# EAGLE design PTI (EAGLE 9.5.1)
DWG_NUMBER: CKT-1000; REV: C; TITLE: PIMTECTOR INTERFACE BOARD
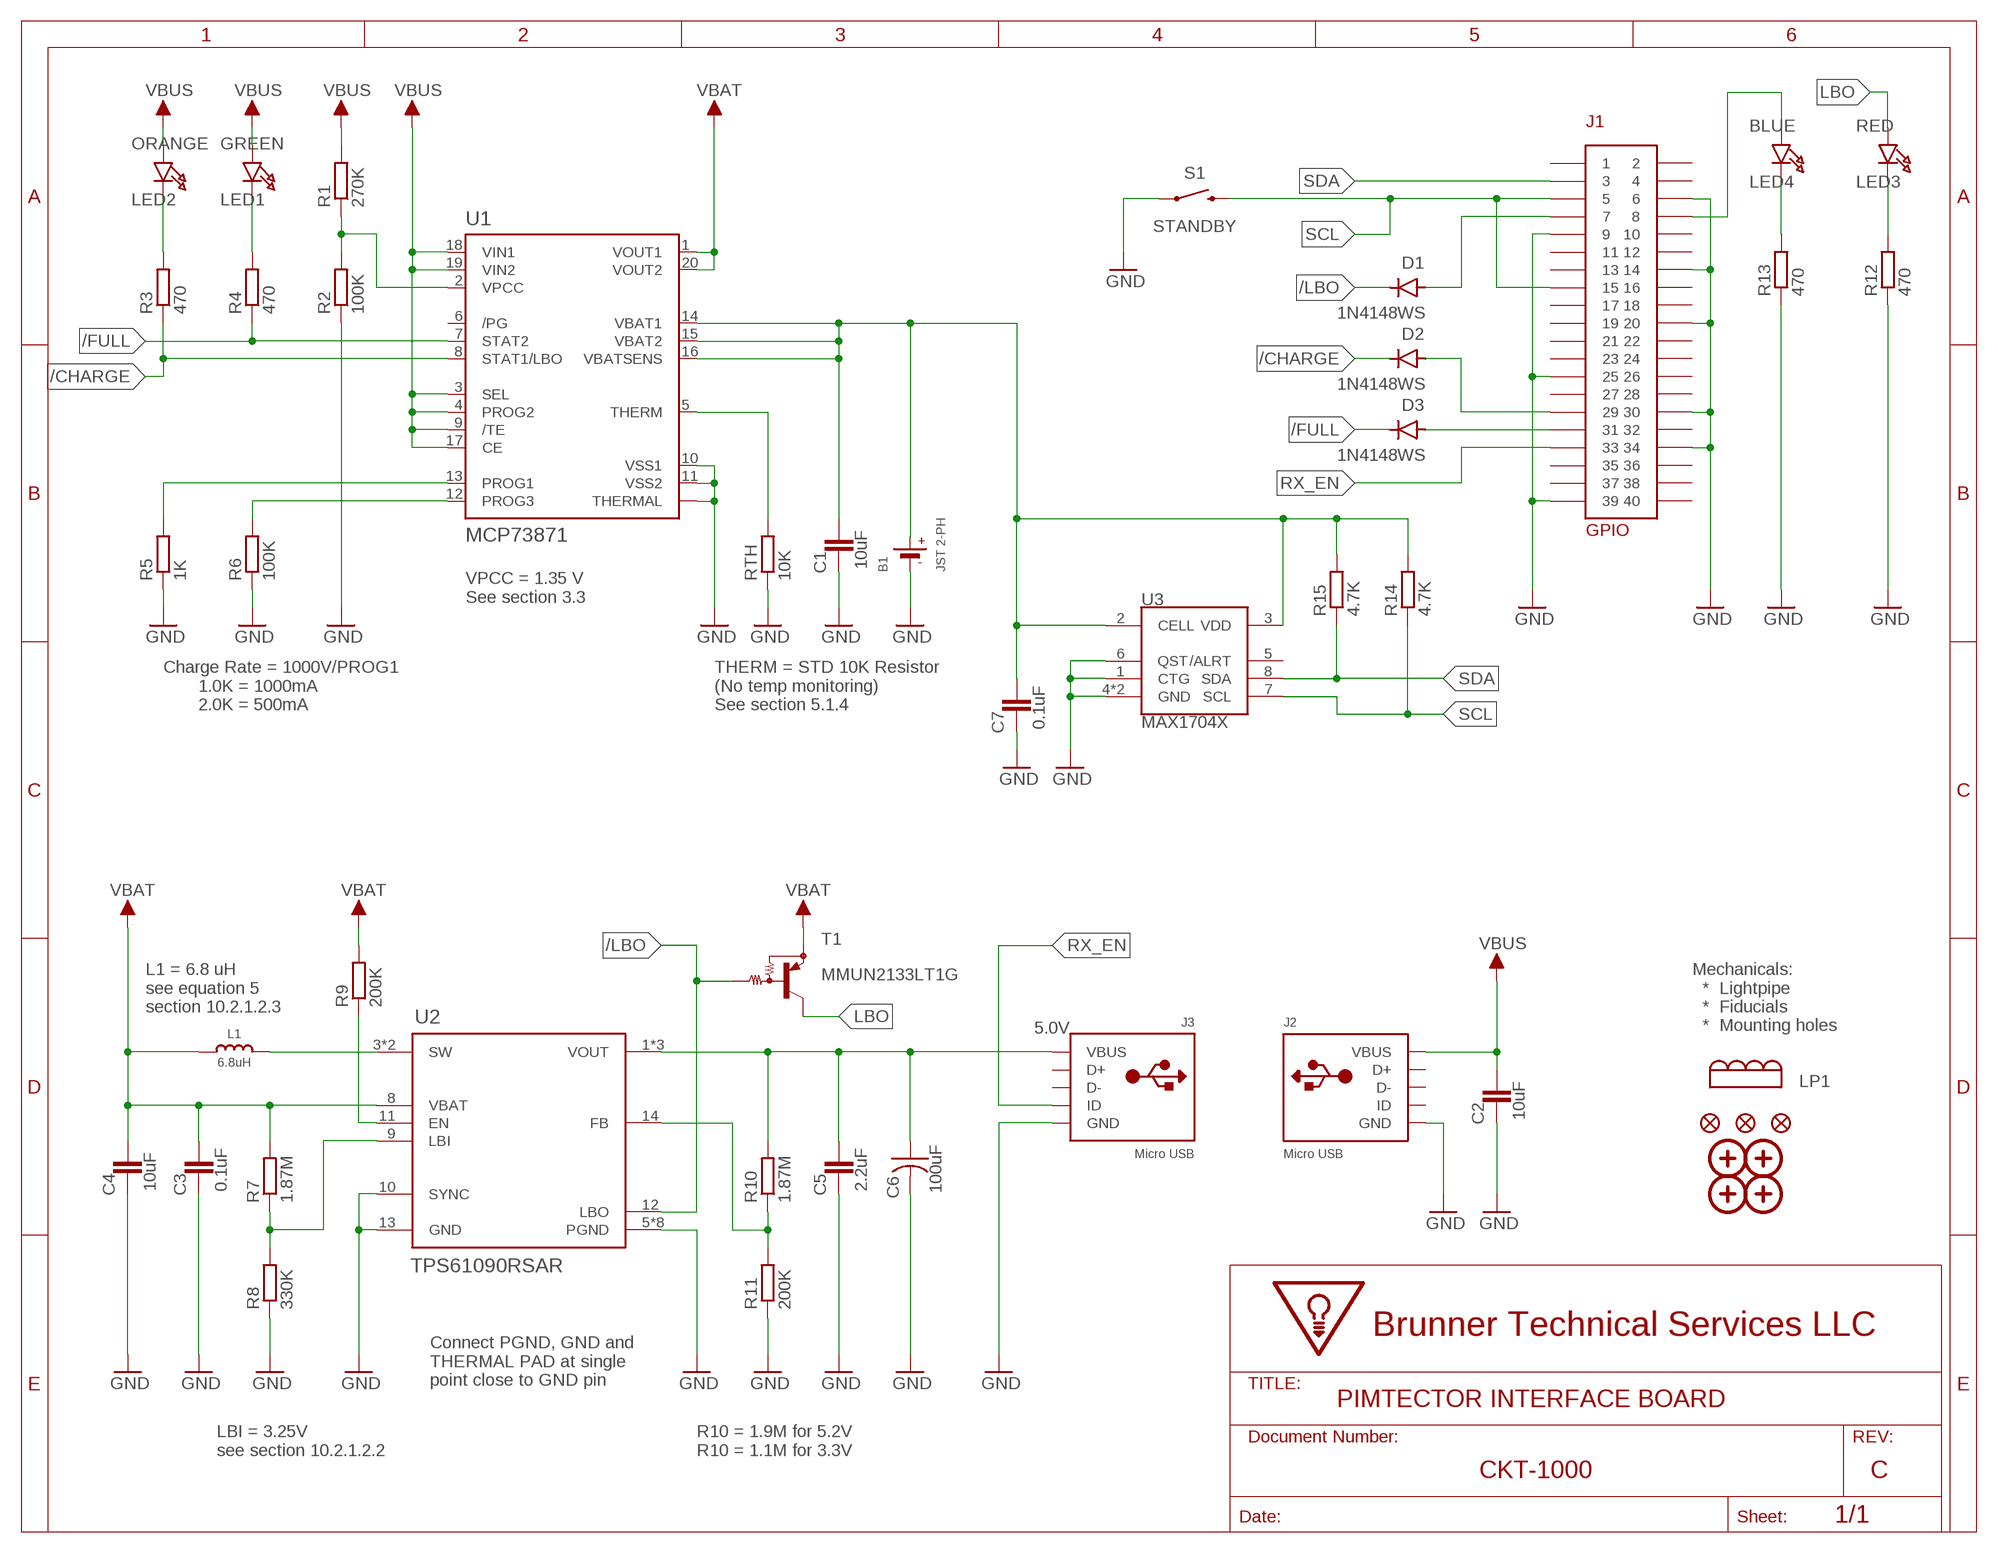
[diagram p0: schematic, sheet 1]

## Parts
B1  JST 2-PH  BATTERY  [JSTPH2]
C1  10uF  C-EUC0805  [C0805]
C2  10uF  C-EUC0805  [C0805]
C3  0.1uF  C-EUC0805  [C0805]
C4  10uF  C-EUC0805  [C0805]
C5  2.2uF  C-EUC0805  [C0805]
C6  100uF  C-USC1210  [C1210]
C7  0.1uF  C-EUC0805  [C0805]
D1  1N4148WS  [SOD-323]
D2  1N4148WS  [SOD-323]
D3  1N4148WS  [SOD-323]
FID1  FIDUCIAL""  [FIDUCIAL_1MM]
FID2  FIDUCIAL""  [FIDUCIAL_1MM]
FID3  FIDUCIAL""  [FIDUCIAL_1MM]
J1  GPIO  HEADER-FE-2X20THRU-HOLE  [HEADER-FE-2X20-TH]
J2  Micro USB  USB  [AMPHENOL_10103594]
J3  Micro USB  USB  [AMPHENOL_10103594]
L1  6.8uH  INDUCTORTDK_VLC5045  [INDUCTOR_5X5MM_TDK_VLC5045]
LED1  GREEN  LED0805_NOOUTLINE  [CHIPLED_0805_NOOUTLINE]
LED2  ORANGE  LED0805_NOOUTLINE  [CHIPLED_0805_NOOUTLINE]
LED3  RED  LED0805_NOOUTLINE  [CHIPLED_0805_NOOUTLINE]
LED4  BLUE  LED0805_NOOUTLINE  [CHIPLED_0805_NOOUTLINE]
LP1  LIGHTPIPE  [LIGHTPIPE_QUAD_VERT_3MM]
MH1  MOUNTING-HOLES  [MOUNTING-HOLE-2.75X3MM]
MH2  MOUNTING-HOLES  [MOUNTING-HOLE-2.75X3MM]
MH3  MOUNTING-HOLES  [MOUNTING-HOLE-2.75X3MM]
MH4  MOUNTING-HOLES  [MOUNTING-HOLE-2.75X3MM]
R1  270K  R-EU_R0805  [R0805]
R2  100K  R-EU_R0805  [R0805]
R3  470  R-EU_R0805  [R0805]
R4  470  R-EU_R0805  [R0805]
R5  1K  R-EU_R0805  [R0805]
R6  100K  R-EU_R0805  [R0805]
R7  1.87M  R-EU_R0805  [R0805]
R8  330K  R-EU_R0805  [R0805]
R9  200K  R-EU_R0805  [R0805]
R10  1.87M  R-EU_R0805  [R0805]
R11  200K  R-EU_R0805  [R0805]
R12  470  R-EU_R0805  [R0805]
R13  470  R-EU_R0805  [R0805]
R14  4.7K  R-EU_R0805  [R0805]
R15  4.7K  R-EU_R0805  [R0805]
RTH  10K  R-EU_R0805  [R0805]
S1  STANDBY  MOMENTARY-SWITCH-SPST-PTH-12MM  [TACTILE_SWITCH_PTH_12MM]
T1  MMUN2133LT1G  MUN2111T1-PNP_DRIVER-SC59-BEC  [SC59-BEC]
U1  MCP73871  [QFN20_4MM]
U2  TPS61090RSAR  TPS6109X  [RSA16_4MMX4MM_VQFN]
U3  MAX1704X  [TDFN-8]

## Nets
5.0V: C5.1 C6.1 J3.VBUS R10.2 U2.1(VOUT) U2.15(VOUT) U2.16(VOUT)
/CHARGE: D2.C R3.1 U1.8(STAT1/LBO)
/FULL: D3.C R4.1 U1.7(STAT2)
/LBO: D1.C T1.B U2.12(LBO)
GND: B1.1(-) B1.NC1(-) B1.NC2(-) C1.2 C2.2 C3.2 C4.2 C5.2 C6.2 C7.2 J1.P$6 J1.P$9 J1.P$14 J1.P$20 J1.P$25 J1.P$30 J1.P$34 J1.P$39 J2.BASE@1(GND) J2.BASE@2(GND) J2.GND J2.SPRT@1(GND) J2.SPRT@2(GND) J2.SPRT@3(GND) J2.SPRT@4(GND) J3.BASE@1(GND) J3.BASE@2(GND) J3.GND J3.SPRT@1(GND) J3.SPRT@2(GND) J3.SPRT@3(GND) J3.SPRT@4(GND) R2.1 R5.1 R6.1 R8.1 R11.1 R12.1 R13.1 RTH.1 S1.1 U1.10(VSS1) U1.11(VSS2) U1.P$21(THERMAL) U1.P$22(THERMAL) U1.P$23(THERMAL) U1.P$24(THERMAL) U2.5(PGND) U2.6(PGND) U2.7(PGND) U2.10(SYNC) U2.13(GND) U2.P$17(PGND) U2.P$18(PGND) U2.P$19(PGND) U2.P$20(PGND) U2.P$21(PGND) U3.1(CTG) U3.4(GND) U3.6(QST) U3.EP(GND)
LBO: LED3.A T1.C
N$1: RTH.2 U1.5(THERM)
N$2: R1.1 R2.2 U1.2(VPCC)
N$3: D1.A J1.P$7
N$4: D2.A J1.P$29
N$5: R5.2 U1.13(PROG1)
N$6: R6.2 U1.12(PROG3)
N$7: LED2.C R3.2
N$8: LED1.C R4.2
N$9: B1.2(+) C1.1 C7.1 R14.2 R15.2 U1.14(VBAT1) U1.15(VBAT2) U1.16(VBATSENS) U3.2(CELL) U3.3(VDD)
N$10: L1.P$2 U2.3(SW) U2.4(SW)
N$11: R7.1 R8.2 U2.9(LBI)
N$13: R9.1 U2.11(EN)
N$15: R10.1 R11.2 U2.14(FB)
N$16: LED3.C R12.2
N$17: D3.A J1.P$31
N$18: LED4.C R13.2
RX_EN: J1.P$33 J3.ID
SCL: J1.P$5 J1.P$15 R14.1 S1.3 U3.7(SCL)
SDA: J1.P$3 R15.1 U3.8(SDA)
STATUS: J1.P$8 LED4.A
VBAT: C3.1 C4.1 L1.P$1 R7.2 R9.2 T1.E U1.1(VOUT1) U1.20(VOUT2) U2.8(VBAT)
VBUS: C2.1 J2.VBUS LED1.A LED2.A R1.2 U1.3(SEL) U1.4(PROG2) U1.9(/TE) U1.17(CE) U1.18(VIN1) U1.19(VIN2)
Unconnected: J1.P$1 J1.P$2 J1.P$4 J1.P$10 J1.P$11 J1.P$12 J1.P$13 J1.P$16 J1.P$17 J1.P$18 J1.P$19 J1.P$21 J1.P$22 J1.P$23 J1.P$24 J1.P$26 J1.P$27 J1.P$28 J1.P$32 J1.P$35 J1.P$36 J1.P$37 J1.P$38 J1.P$40 J2.D+ J2.D- J2.ID J3.D+ J3.D- U1.6(/PG) U3.5(/ALRT)

## Notes on the sheet
- VPCC = 1.35 V
  See section 3.3
- Charge Rate = 1000V/PROG1
         1.0K = 1000mA
         2.0K = 500mA
- THERM = STD 10K Resistor
  (No temp monitoring)
  See section 5.1.4
- L1 = 6.8 uH
  see equation 5
  section 10.2.1.2.3
- Mechanicals:
    *  Lightpipe
    *  Fiducials
    *  Mounting holes
- Connect PGND, GND and
  THERMAL PAD at single
  point close to GND pin
- LBI = 3.25V
  see section 10.2.1.2.2
- R10 = 1.9M for 5.2V
  R10 = 1.1M for 3.3V

## Library data of the parts
B1 = brunnertech:BATTERY: CR1220 SMT - Digikey: 3001K-ND CD2032 BAT-HLD-001 - Digikey: BAT-HLD-001-ND
C1-C5 C7 = brunnertech:C-EU: CAPACITOR, European symbol; SPICEPREFIX: C
C6 = brunnertech:C-US: CAPACITOR, American symbol; SPICEPREFIX: C
D1-D3 = brunnertech:1N4148WS: DIODE GEN PURP 75V 150MA SOD323F Manufacturer's datasheet <https://www.onsemi.com/pub/Collateral/1N914BWS-D.pdf>; CREATED_BY: PCBLayout.com; DIGIKEY_PART_NUMBER: 1N4148WSFSTR-ND; MANUFACTURER: Diodes Incorporated; MPN: 1N4148WS; PACKAGE: SOD-323
FID1-FID3 = brunnertech:FIDUCIAL: Fiducial Alignment Points Various fiducial points for machine vision alignment.; BOM: EXCLUDE
J1 = brunnertech:HEADER-FE-2X20
J2 J3 = brunnertech:USB: USB Connectors USBMINIB - Surface Mount Female Mini-B USB Connector 4UConnector: 06564
L1 = brunnertech:INDUCTOR: Inductors 0603: 10nH Ceramic Inductor - microwire antenna/RF (Digikey: 712-1434-2-ND) 0805: 560nH Ceramic Inductor - RF (Digikey: 553-1047-1-ND) 270nH Ceramic Inductor - Q = 40@250MHz, +-5%, 1 Ohm DC Resistance (Digikey: 535-10506-2-ND) 1007 (2518 Metric) SMT: 10µH 10% 250mOhm 820mA 1007 Inductor (Digikey: 587-2189-1-ND) 22µH 10% 500mOhm 580mA 1007 Inductor (Digikey: 587-2190-1-ND) 47µH 10% 950mOhm 420mA 1007 Inductor (Digikey: 587-2191-1-ND) 47µH 5% 100mOhm 1A 1008 Inductor (Digikey: 732-1816-1-ND) 5.0x5.0mm (Taiyo Yuden NR5040 Series) 6.8µH 20% 2.3A 64mOhm Inductor (Digikey: 587-2374-2-ND) 5.0x5.0mm (TDK VLC5045 Series) 4.7µH 20% 3.3A 34mOhm Inductor (Digikey: 445-6526-1-ND) 6.8µH 20% 2.7A 46mOhm Inductor (Digikey: 445-6527-1-ND) 6.0x6.0mm (TDK VLC6045 Series) 4.7µH 20% 3.8A 27mOhm Inductor (Digikey: 445-6538-2-ND) 6.8µH 20% 3A 41mOhm Inductor (Digikey: 445-6540-1-ND) 6.2µH 30% 2.2A 45mOhm Inductor (Digikey: SRR5028-6R2YCT-ND) - Not TDK VLC6045 but footprint should match 6.0x6.0mm (TDK SLF6045 Series) 6.8uH 30% 2A 33mOhm Inductor (Digikey: 445-4572-1-ND, Mouser: 810-SLF645T6R8N2R0PF) 6.0x6.0mm (Sumida CDRH5D28 Series) 6.2uH 30% 1.8A 45mOhm Inductor (Digikey: 308-1542-1-ND) Taiyo Yuden NR3015T2R2M - 2.2uH 20% 1.5A (Digikey: 587-1648-2-ND, Mouser: 963-NR3015T2R2M) - Used with TI TPS62172 CoilCraft RFID Transponder Coil - MA5532-AE (For use with AS3935 Lightning Sensor) Vishay IHLP 1.0uH Molded Inductor - 24mOhm DCR, 5A, +/-20%, -55°C-125°C (Digikey: 541-1319-1-ND)
LED1-LED4 = brunnertech:LED: LED 0603 - 0603 Surface Mount Package 2mA: Green LED - Low Power (3.9mcd, 2ma, 1.7Vf) - Digikey: 475-2709-2-ND Orange LED - Low Power (9.8mcd, 2ma, 1.8Vf) - Digikey: 475-1194-2-ND Red LED - Low Power (5mcd, 2ma, 1.8Vf) - Digikey: 475-1195-2-ND Yellow LED - Low Power (7mcd, 2ma, 1.8Vf) - Digikey: 475-1196-2-ND 5mA: Blue LED - Low Power (17mcd, 5ma, 2.9Vf) - Digikey: LNJ937W8CRACT-ND 0805 - 0805 Surface Mount Package 2mA: Red LED (8.8mcd, 2mA, 1.8Vf, Clear) - Low Power [Digikey: 475-2510-1-ND] Green LED (5mcd, 2mA, 1.8Vf, Clear) - Low Power [Digikey: 475-2730-1-ND] Yellow LED (11.3mcd, 2mA, 1.8Vf, Clear) - Low Power [Digikey: 475-2555-1-ND] 20mA: Red LED (104mcd, 20mA, Diffused) - LS R976 [Digikey: 475-1278-6-ND] Red LED (12mcd, 20mA, 2.0Vf, Clear) - APT2012EC [Digikey: 754-1128-1-ND] Green LED (15mcd, 20mA, 2.2Vf, Clear) - APT2012GC [Digikey: 754-1131-1-ND] Orange LED (160mcd, 20mA, 2.1Vf, Clear) - APT2012SECK [Digikey: 754-1130-1-ND] 1206 - 1206 Surface Mount Package Green LED (26mcd, 20mA, Diffused) - LG N971 [Digikey: 475-1407-6-ND] Red LED (15mcd, 20mA, Diffused) - LH N974 [Digikey: 475-1416-6-ND] Cree - Cree High-Power Surface Mount LEDs XPEBWT-L1-0000-00D50 - White 111lm 350mA 2.9Vf 6200K 110° XTEAWT-00-0000-00000LEE3 - White 114lm 350mA 2.85Vf 5000K 115° Everlight - Everlight 45-21 Series Surface Mount LEDs 45-21/QK2C-B2832AC2CB2/2T - Warm White 2000mcd 20mA 3.25Vf 3050K 120° 45-21/LK2C-B38452C4CB2/2T - Nuetral White 2000mcd 20mA 3.25Vf 4150K 120° 45-21/LK2C-B50634C6CB2/2T - Cold White 2200mcd 20mA 3.25Vf 5650K 120° PLCC2 Reverse Mount LS T77K-J1L2-1-0-2-R18-Z - Red 11.25mcd 2mA 1.8Vf 630nm 120° LO T77K-L1M2-24-Z - Orange 19.6mcd 2mA 1.8Vf 606nm 120° LY T77K-K2M1-26-Z - Yellow 15.7mcd 2mA 1.8Vf 587nm 120°
LP1 = brunnertech:LIGHTPIPE: Lightpipe assembly
MH1-MH4 = brunnertech:MOUNTING-HOLES
R1-R15 RTH = brunnertech:R-EU_: RESISTOR, European symbol; SPICEPREFIX: R
S1 = brunnertech:MOMENTARY-SWITCH-SPST: Momentary Switch (Pushbutton) - SPST Normally-open (NO) SPST momentary switches (buttons, pushbuttons). Variants PTH-12MM - 12mm square, through-hole Momentary Pushbutton Switch - 12mm Square <https://www.sparkfun.com/products/9190> (COM-09190) PTH-6.0MM, PTH-6.0MM-KIT - 6.0mm square, through-hole Mini Pushbutton Switch <https://www.sparkfun.com/products/97> (COM-00097) KIT package intended for soldering kit's - only one side of pads' copper is exposed. PTH-RIGHT-ANGLE-KIT - Right-angle, through-hole Right Angle Tactile Button <https://www.sparkfun.com/products/10791> - Used on SparkFun BigTime Watch Kit <https://www.sparkfun.com/products/11734> SMD-12MM - 12mm square, surface-mount Tactile Button - SMD (12mm) <https://www.sparkfun.com/products/12993> (COM-12993) Used on SparkFun PicoBoard <https://www.sparkfun.com/products/11888> SMD-4.5MM - 4.5mm Square Trackball Switch Used on SparkFun Blackberry Trackballer Breakout <https://www.sparkfun.com/products/13169> SMD-4.6MMX2.8MM - 4.60mm x 2.80mm, surface mount Used on SparkFun SAMD21 Mini Breakout <https://www.sparkfun.com/products/13664> SMD-5.2MM, SMD-5.2-REDUNDANT - 5.2mm square, surface-mount Mini Pushbutton Switch - SMD <https://www.sparkfun.com/products/8720> (COM-08720) Used on Arduino Pro Mini <https://www.sparkfun.com/products/11114> REDUNDANT package connects both switch circuits together SMD-6.0X3.5MM - 6.0 x 3.5mm, surface mount Momentary Reset Switch SMD <https://www.sparkfun.com/products/8229> (COM-08229) SMD-6.2MM-TALL - 6.2mm square, surface mount Tactile Button - SMD (6mm) <https://www.sparkfun.com/products/12992> Used on SparkFun Digital Sandbox <https://www.sparkfun.com/products/12651> SMD-RIGHT-ANGLE - Right-angle, surface mount Used on SparkFun Block for Intel® Edison - Arduino <https://www.sparkfun.com/products/13036>; PROD_ID: SWCH-09185; SF_SKU: COM-09190
T1 = brunnertech:*-PNP_DRIVER-: PNP Bias Resistor Transistor
U1 = brunnertech:MCP73871: MCP73871 Lithium Polymer Battery Charger Digikey: MCP73871-2CCI/ML-ND
U2 = brunnertech:TPS6109X: Synchronous Boost Converter with 2A Switch; MANUFACTURER: TI
U3 = brunnertech:MAX1704X: MAX17043/MAX17044: Battery Fuel Guage (43 is 1cell, 44 is 2cell)

## Board
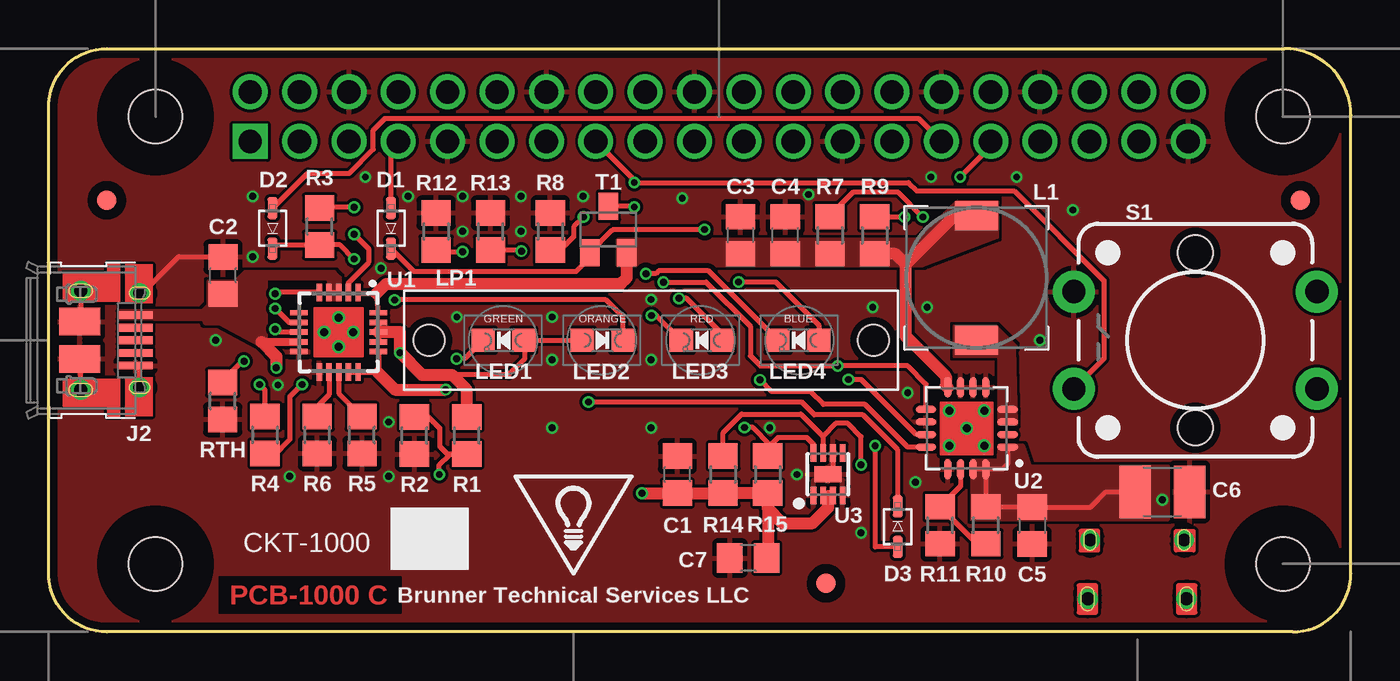
[diagram p1: board, top side]
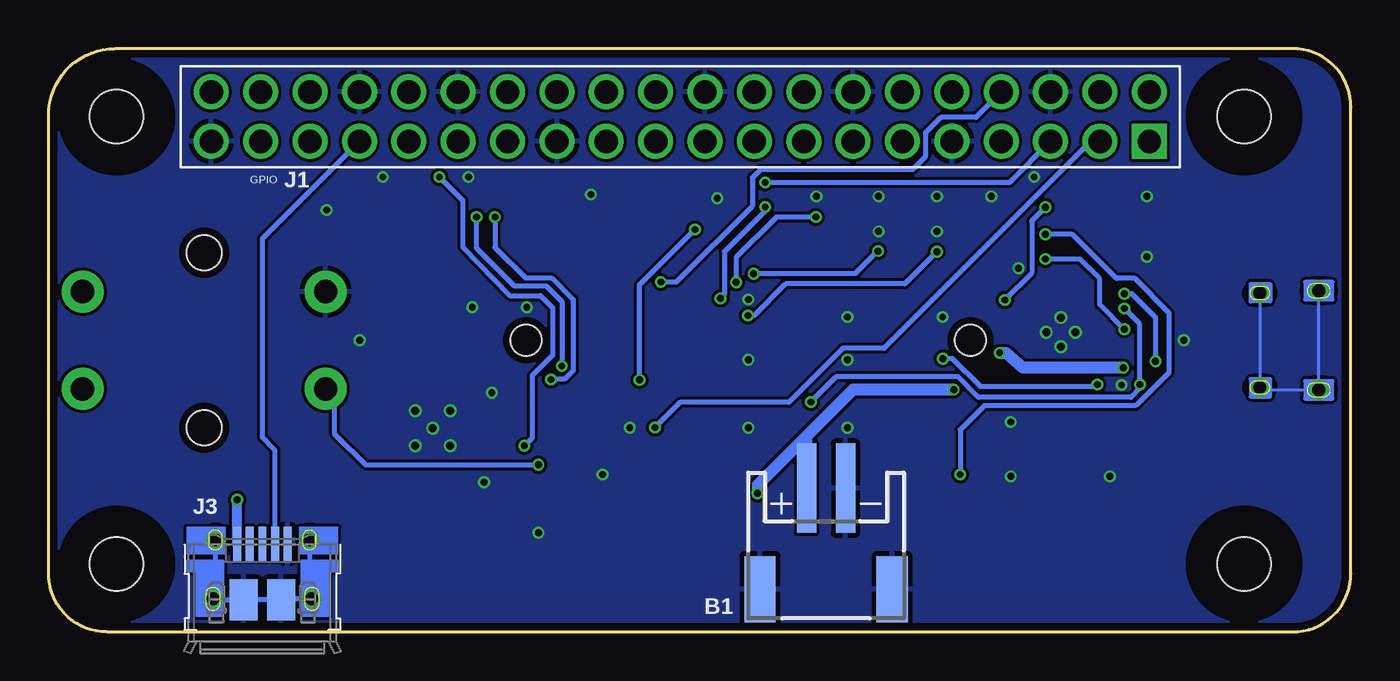
[diagram p2: board, bottom side, seen from below]

Size 67 x 30 mm. Coordinates in mm from the lower left corner, seen from the top.
Outline: 64,0 3,0 arc-90 0,3 0,27 arc-90 3,30 63.59,30 arc-90 67,26.59 67,3 arc-90 64,0
Copper layers (1*16): Top 0.035559375mm / dielectric 1.6mm / Bottom 0.035559375mm
Design rules "oshpark-2layer *": minimum track width 6mil, minimum drill 10mil, track to track 6mil, track to pad 6mil, pad to pad 6mil, via to via 6mil, smd to smd 6mil, copper to edge 15mil, drill to drill 6mil, minimum pad ring 5mil, minimum via ring 5mil, stop-mask expansion 2.5mil, vias tented up to drill 0mil, thermal gap 10mil

### Footprints (pad centres in the part's own frame; a part is rotated, then mirrored left to right if it is on the bottom)
JSTPH2 = smd 1 x 4.6: 1 -1,-3.7; 2 1,-3.7 | smd 1.6 x 3.4: NC1 -3.4,1.5; NC2 3.4,1.5
C0805 = smd 1.3 x 1.5: 1 -0.95,0; 2 0.95,0
C1210 = smd 1.6 x 2.7: 1 -1.4,0; 2 1.4,0
SOD-323 = smd 1.14 x 0.52: A 1.04,0; C -1.04,0
FIDUCIAL_1MM = smd 1 x 1: 1 0,0
HEADER-FE-2X20-TH = drill 1.2 square: P$1 1.27,24.13 | drill 1.2: P$2 -1.27,24.13; P$3 1.27,21.59; P$4 -1.27,21.59; P$5 1.27,19.05; P$6 -1.27,19.05; P$7 1.27,16.51; P$8 -1.27,16.51; P$9 1.27,13.97; P$10 -1.27,13.97; P$11 1.27,11.43; P$12 -1.27,11.43; P$13 1.27,8.89; P$14 -1.27,8.89; P$15 1.27,6.35; P$16 -1.27,6.35; P$17 1.27,3.81; P$18 -1.27,3.81; P$19 1.27,1.27; P$20 -1.27,1.27; P$21 1.27,-1.27; P$22 -1.27,-1.27; P$23 1.27,-3.81; P$24 -1.27,-3.81; P$25 1.27,-6.35; P$26 -1.27,-6.35; P$27 1.27,-8.89; P$28 -1.27,-8.89; P$29 1.27,-11.43; P$30 -1.27,-11.43; P$31 1.27,-13.97; P$32 -1.27,-13.97; P$33 1.27,-16.51; P$34 -1.27,-16.51; P$35 1.27,-19.05; P$36 -1.27,-19.05; P$37 1.27,-21.59; P$38 -1.27,-21.59; P$39 1.27,-24.13; P$40 -1.27,-24.13
AMPHENOL_10103594 = smd 1.425 x 2.1: BASE@1 -0.963,-0.05; BASE@2 0.963,-0.05 | smd 0.4 x 1.75: D+ 0,2.825; D- -0.65,2.825; GND 1.3,2.825; ID 0.65,2.825; VBUS -1.3,2.825 | drill 0.65 pad 1: SPRT@1 -2.425,3.03; SPRT@2 2.425,3.03 | drill 0.68 pad 1: SPRT@3 -2.54,0; SPRT@4 2.54,0
INDUCTOR_5X5MM_TDK_VLC5045 = smd 1.5 x 2.2: P$1 -3.2,0; P$2 3.2,0
CHIPLED_0805_NOOUTLINE = smd 1.2 x 1.2: A 0,-1.05; C 0,1.05
LIGHTPIPE_QUAD_VERT_3MM = hole 1.6: 11.43,0; -11.43,0
MOUNTING-HOLE-2.75X3MM = hole 2.75: 0,0
R0805 = smd 1.3 x 1.5: 1 -0.95,0; 2 0.95,0
TACTILE_SWITCH_PTH_12MM = drill 1.2 pad 2.159: 1 6.25,-2.5; 2 -6.25,-2.5; 3 6.25,2.5; 4 -6.25,2.5 | hole 1.8: 0,4.5; 0,-4.5
SC59-BEC = smd 1 x 1.4: B -0.95,-1.2; C 0,1.2; E 0.95,-1.2
QFN20_4MM = smd 0.9 x 0.28: 1 -2.05,1; 2 -2.05,0.5; 3 -2.05,0; 4 -2.05,-0.5; 5 -2.05,-1; 11 2.05,-1; 12 2.05,-0.5; 13 2.05,0; 14 2.05,0.5; 15 2.05,1 | smd 0.28 x 0.9: 6 -1,-2.05; 7 -0.5,-2.05; 8 0,-2.05; 9 0.5,-2.05; 10 1,-2.05; 16 1,2.05; 17 0.5,2.05; 18 0,2.05; 19 -0.5,2.05; 20 -1,2.05 | drill 0.4: P$21 0,0.75; P$22 -0.75,0; P$23 0,-0.75; P$24 0.75,0
RSA16_4MMX4MM_VQFN = smd 1.05 x 0.35: 1 -2.1,0.975; 2 -2.1,0.325; 3 -2.1,-0.325; 4 -2.1,-0.975; 9 2.1,-0.975; 10 2.1,-0.325; 11 2.1,0.325; 12 2.1,0.975 | smd 0.35 x 1.05: 5 -0.975,-2.1; 6 -0.325,-2.1; 7 0.325,-2.1; 8 0.975,-2.1; 13 0.975,2.1; 14 0.325,2.1; 15 -0.325,2.1; 16 -0.975,2.1 | drill 0.4: P$17 0,0; P$18 -0.9,0.9; P$19 0.9,0.9; P$20 -0.9,-0.9; P$21 0.9,-0.9
TDFN-8 = smd 0.9 x 0.3: 1 -1.09,0.75; 2 -1.09,0.25; 3 -1.09,-0.25; 4 -1.09,-0.75; 5 1.09,-0.75; 6 1.09,-0.25; 7 1.09,0.25; 8 1.09,0.75 | smd 0.8 x 1.38: EP 0,0

### Placement (x,y rotation side)
B1  27,3.7 180 bottom
C1  32.35,8.09 90 top
C2  8.97,18.34 90 top
C3  35.6,20.4 90 top
C4  37.9,20.4 90 top
C5  50.6,5.47 270 top
C6  57.3,7.2 0 top
C7  36,3.8 180 top
D1  17.61,20.76 90 top
D2  11.53,20.76 90 top
D3  43.69,5.42 270 top
FID1  64.4,22.2 0 top
FID2  3,22.2 0 top
FID3  40,2.5 0 top
J1  34.5,26.5 270 bottom
J2  1.65,15 270 top
J3  56,1.7 0 bottom
L1  47.73,18.21 270 top
LED1  23.4,15 90 top
LED2  28.5,15 270 top
LED3  33.6,15 90 top
LED4  38.57,15 90 top
LP1  31,15 0 top
MH1  5.5,3.5 0 top
MH2  5.5,26.5 0 top
MH3  63.5,26.5 0 top
MH4  63.5,3.5 0 top
R1  21.52,10.1 90 top
R2  18.82,10.1 90 top
R3  13.94,20.85 90 top
R4  11.13,10.13 270 top
R5  16.12,10.13 90 top
R6  13.82,10.13 90 top
R7  40.2,20.4 270 top
R8  25.81,20.6 270 top
R9  42.5,20.4 270 top
R10  48.22,5.49 90 top
R11  45.87,5.49 90 top
R12  19.94,20.6 270 top
R13  22.73,20.6 270 top
R14  34.7,8.1 270 top
R15  37,8.1 270 top
RTH  8.95,11.88 90 top
S1  59,15 180 top
T1  28.8,20.7 0 top
U1  14.92,15.41 270 top
U2  47.24,10.47 180 top
U3  40.1,8.11 90 top

### Tracks (layer width: path | path; a pad name or v marks a point on that pad's centre or on a via)
5.0V  (via drill 0.35)
  Top 0.254: U2.1 49.34,8.64 49.08,8.38 U2.16 | U2.16 U2.15 | U2.16 R10.2 50.59,6.44 | C5.1 53.62,6.42 54.4,7.2 C6.1
  Top 0.61: C5.1 50.59,6.44
  Bottom 0.152: v57.3,6.8 57.3,6.79
  Bottom 0.508: J3.VBUS 57.3,6.79
  pour Top (no thermals): 47.5,8.8 47.5,5.8 57.6,5.8 57.6,8.5 50.52,8.5 50.14,9.57 48.89,9.57 48.85,8.8
/CHARGE  (via drill 0.35)
  Top 0.254: D2.C 11.71,19.9 R3.1 14.99,19.9 v15.72,19.18 | U1.8 11.81,15.41 v11.65,15.57
  Bottom 0.254: v11.65,15.57 12.92,16.84 12.92,18.16 13.94,19.18 v15.72,19.18
/FULL  (via drill 0.35)
  Top 0.254: U1.7 12.37,15.91 v11.65,16.64 | v10.85,12.72 11.13,12.45 R4.1 | v27.78,11.83 38.73,11.83 39.4,11.16 41.89,11.16 43.69,9.36 D3.C
  Bottom 0.254: v11.65,16.64 10.89,15.88 10.89,12.76 v10.85,12.72 10.85,12.52 11.31,12.07 19.15,12.07 20.2,13.12 26.49,13.12 v27.78,11.83
/LBO  (via drill 0.35)
  Top 0.254: v33.75,20.7 33.72,20.67 29.02,20.67 T1.B 27.85,19.25 27.15,18.54 18.79,18.54 D1.C | U2.12 44.2,9.5 42,11.7 39.86,11.7 39.2,12.36 37.2,12.36 v36.6,12.96
  Bottom 0.254: v36.6,12.96 36.6,17.85 v33.75,20.7
GND  (via drill 0.35)
  Top 0.254: J2.SPRT@3 1.65,16.01 J2.BASE@1 | J2.SPRT@4 1.65,13.99 J2.BASE@2 | J2.SPRT@2 4.68,13.49 J2.GND | J2.SPRT@1 4.83,17.43 6.7,19.3 8.96,19.3 C2.2 | U3.6 40.35,8.36 U3.EP
  Bottom 0.152: J2.SPRT@1 J2.SPRT@2 4.57,12.46 J2.SPRT@4 J2.SPRT@3
  Bottom 0.254: J3.SPRT@3 58.49,1.65 | 58.49,1.65 J3.BASE@1 J3.BASE@2 54.99,1.7 J3.SPRT@4 53.58,1.81 J3.SPRT@2 | J3.SPRT@1 58.42,1.72 58.49,1.65
  other vias: 31,10.5 44.2,12.3 45.2,16.7 42.4,16.7 31,17.1 31,14 51,15 25.9,16.2 21,16.2 32.6,22.3 27.5,22.4 39.1,22.5 49.8,23.4 52.7,21.7 45.4,23.4 24.3,20.6 21.3,20.6 21.3,22.4 24.3,22.4 16.3,23.4 18.5,22.4 17.1,18.7 10.5,22.4 25.9,10.5 25.9,14 17.5,10.8 8.6,15 11.8,12.7 10.5,19.3 12.4,8 17.5,8 41.8,5.1 38.5,8.1 44.6,7.7 37.1,10.5
  cutout Top (no thermals): 8.8,2.8 8.8,1 18.1,1 18.1,2.8
  pour Top (rank 2): 3,30 64,30 arc-90 67,27 67,3 arc-90 64,0 3,0 arc-90 0,3 0,27 arc-90
  pour Bottom (rank 2): 3,30 64,30 arc-90 67,27 67,3 arc-90 64,0 3,0 arc-90 0,3 0,27 arc-90
LBO  (via drill 0.35)
  Top 0.254: v30.13,21.86 30.13,21.9 T1.C | v32.43,17.15 32.83,17.15 34.65,15.33 LED3.A
  Bottom 0.254: v32.43,17.15 32.23,17.35 32.23,19.56 30.13,21.66 v30.13,21.86
N$1  (via drill 0.35)
  Top 0.254: v11.66,17.4 11.73,17.46 U1.5 | RTH.2 8.95,12.93 10.05,14.03 v10.05,13.92
  Bottom 0.254: v10.05,13.92 10.05,16.18 11.27,17.4 v11.66,17.4
N$2  (via drill 0.35)
  Top 0.254: U1.2 15.42,17.97 16.48,19.02 16.48,19.68 v15.72,20.45 | v20.1,8.1 20.1,8.6 20.65,9.15 R1.1 20.52,9.15 20.12,9.55 20.12,10.48 19.55,11.05 R2.2
  Bottom 0.254: v15.72,20.45 14.32,20.45 12.06,18.19 11.13,18.19 9.34,16.4 9.34,13.36 11.06,11.64 18.86,11.64 20.1,10.4 v20.1,8.1
N$3
  Top 0.254: D1.A 17.61,24.86 J1.P$7
N$4
  Top 0.254: D2.A 13.33,23.6 15.49,23.6 16.7,24.81 16.7,25.8 17.31,26.41 44.75,26.41 J1.P$29
N$5
  Top 0.254: U1.13 14.92,12.28 R5.2
N$6
  Top 0.254: U1.12 14.42,12.2 13.94,11.72 13.94,11.2 R6.2
N$7  (via drill 0.35)
  Top 0.254: LED2.C 29.55,16.2 28.68,17.07 v17.8,17.07 | v15.72,21.84 13.98,21.84 R3.2
  Bottom 0.254: v15.72,21.84 16.42,21.14 16.42,18.46 v17.8,17.07
N$8  (via drill 0.35)
  Top 0.254: R4.2 11.53,9.58 11.53,9.02 12.41,9.91 12.41,12.09 v13.05,12.73 | LED1.C 21.41,14.06 v20.99,14.06
  Bottom 0.254: v20.99,14.06 20.49,14.06 19.06,12.63 13.15,12.63 v13.05,12.73
N$9  (via drill 0.35)
  Top 0.254: U1.14 U1.15 16.91,13.37 | 16.91,13.37 16.97,13.31 | U1.16 16.97,13.42 16.91,13.37 | U3.2 40.08,7.02 | 40.08,7.02 40.1,7 | 40.08,7.02 U3.3
  Top 0.61: 16.97,13.31 17.82,12.46 v20.43,12.46 | v30.53,7.13 30.54,7.14 C1.1 R14.2 R15.2 | R15.2 37,3.85 C7.1 | 40.1,7 40.1,6.4 39.3,5.6 37.75,5.6 37,6.35 R15.2
  Bottom 0.61: v20.43,12.46 25.61,12.46 28,10.07 | B1.2 28,10.07 | v30.53,7.13 30.53,7.54 28,10.07
N$10
  pour Top (no thermals): 46.6,15.7 46.6,14.2 48.9,14.2 48.9,10.7 49.78,10.7 49.68,14.58 49.76,14.66 48.73,15.7
N$11  (via drill 0.35)
  Top 0.254: v44.98,21.34 43.71,22.61 41.37,22.61 40.2,21.44 R7.1 | v27.53,21.34 27.02,20.83 27.02,20.32 26.35,19.65 R8.2 | v31.63,17.99 33.83,17.99 36.1,15.72 36.1,14.2 36.62,13.68 v40.59,13.68 44.21,13.68 45.14,12.75 U2.9
  Bottom 0.254: v44.98,21.34 44.98,19.74 43.04,17.8 41.4,17.8 40.59,16.99 v40.59,13.68 | v27.53,21.34 29.56,21.34 31.63,19.27 v31.63,17.99
N$13  (via drill 0.35)
  Top 0.254: v44.04,21.34 42.51,21.34 R9.1 | v41.15,12.98 41.82,12.98 44.65,10.15 U2.11
  Bottom 0.254: v44.04,21.34 44.04,19.77 42.47,18.21 41.13,18.21 40.01,17.09 40.01,13.44 40.45,13 41.13,13 v41.15,12.98
N$15
  Top 0.254: U2.14 46.91,7.48 R11.2 47.77,4.54 R10.1
N$16  (via drill 0.35)
  Top 0.254: R12.2 20.03,19.56 v21.3,19.56 | v31.02,16.27 31.28,16.27 LED3.C
  Bottom 0.254: v21.3,19.56 22.95,17.91 29.08,17.91 30.72,16.27 v31.02,16.27
N$17  (via drill 0.35)
  Top 0.254: J1.P$31 48.47,24.97 v46.9,23.4 | D3.A 42.52,4.38 v42.52,9.57
  Bottom 0.254: v46.9,23.4 45.69,22.19 45.69,19.79 43.28,17.3 41.7,17.3 41.07,16.67 41.07,14.22 42.12,13.17 42.12,9.97 v42.52,9.57
N$18  (via drill 0.35)
  Top 0.254: R13.2 24.26,19.65 v24.32,19.59 | v30.73,18.43 31.24,18.43 31.39,18.57 33.95,18.57 LED4.C
  Bottom 0.254: v24.32,19.59 24.5,19.41 24.52,19.41 25.51,18.43 v30.73,18.43
RX_EN
  Bottom 0.254: J1.P$33 56,20.24 56,10 55.35,9.35 J3.ID
SCL  (via drill 0.35)
  Top 0.254: S1.3 54.3,14.05 54.3,18.07 49.69,22.69 44.67,22.69 44.24,23.11 v30.13,23.11 30.13,23.25 J1.P$15 | R14.1 34.7,10.25 35.65,11.2 38.7,11.2 39.83,10.07 | v41.8,8.6 41.8,10.04 41.12,10.73 40.48,10.73 39.83,10.07 | 39.83,10.07 39.85,10.05 U3.7
  Bottom 0.254: J1.P$5 17.57,23.11 v30.13,23.11 | S1.3 52.3,12.05 52.3,10.2 50.7,8.6 v41.8,8.6
SDA  (via drill 0.35)
  Top 0.254: R15.1 37,9.45 37.15,9.6 | 37.15,9.6 37.55,10 39,10 39.35,9.65 U3.8 | 37.15,9.6 36.23,10.52 v35.8,10.52
  Bottom 0.254: v35.8,10.52 34.52,11.8 28.92,11.8 26.14,14.58 24.02,14.58 13.37,25.23 J1.P$3
STATUS  (via drill 0.35)
  Top 0.254: v35.5,18 37.4,18 39.62,15.78 LED4.A
  Bottom 0.254: J1.P$8 19.29,26.47 21.09,26.47 21.89,25.67 21.89,24.44 22.56,23.78 30.38,23.78 30.8,23.36 30.8,21.9 34.7,18 v35.5,18
VBAT
  Top 0.254: U1.20 16.89,17.37 16.86,17.4 15.94,17.4 U1.1
  Top 0.61: 16.86,17.4 17.37,17.91 29.43,17.91 29.75,18.23 T1.E | U2.8 46.16,12.68 46.16,13.14 44.1,15.2 44.1,18.9 | 44.1,18.9 43.55,19.45 R9.2 | L1.P$1 46.61,21.41 44.1,18.9
  pour Top (isolate 0.254, no thermals): 29.3,20.19 44.81,20.19 46.74,22.12 48.8,22.12 48.8,20.3 44.92,18.82 29.3,18.82
VBUS  (via drill 0.35)
  Top 0.254: U1.19 U1.18 U1.17 | U1.4 U1.3 | LED2.A LED1.A 24.5,14.95 24.5,14.05 23.67,13.22 20.75,13.22
  Top 0.406: 10.96,14.91 U1.9
  Top 0.61: U1.18 18.07,15.41 v18.07,14.35 19.2,13.22 20.75,13.22 21.49,12.48 21.49,11.05 R1.2 | 10.96,14.91 11.71,14.16 v11.71,13.59
  Bottom 0.61: v11.71,13.59 16.87,13.59 17.76,14.35 v18.07,14.35
  pour Top (no thermals): 8.2,18 8.2,16.8 7.9,16.5 3.7,16.5 3.7,16.1 7.95,16.1 8.05,15.88 8.8,15.88 10.8,14.8 11.2,14.8 11.2,18.2 14.3,18.2 14.4,18.1 14.4,17.1 15,17.1 15,18.2 14.7,18.5 10.1,18.5 9.6,18

### Text on the board
Top: PCB-1000 C
tPlace: CKT-1000 | Brunner Technical Services LLC